# Altium project Placas para Carlos.PrjPcb
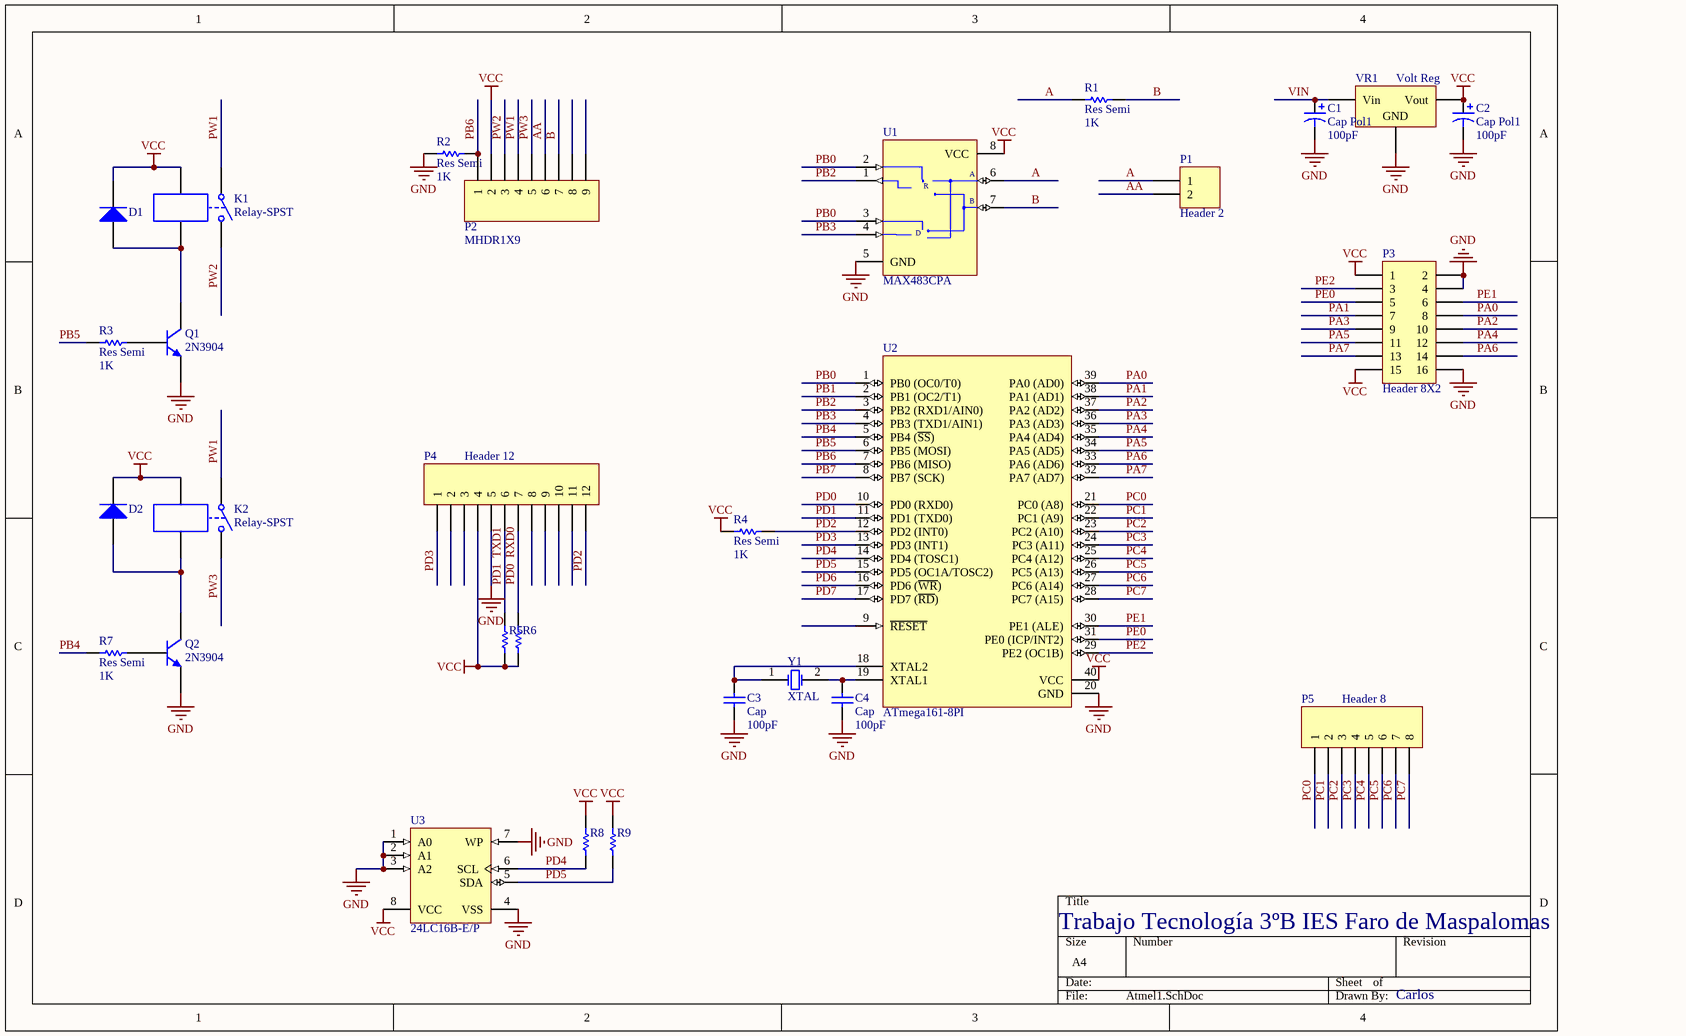
[diagram p0: Atmel1.SchDoc]
1 sheet, 29 parts. Net scope: global (net labels, ports and power ports of the same name join across sheets).

## Sheet Atmel1.SchDoc
size A4; PageSetup: Record=PageOptions|CenterHorizontal=True|CenterVertical=True|PrintScale=0.97|XCorrection=1.00|YCorrection=1.00|PrintKind=0|BorderSize=5000000|LeftOffset=0|BottomOffset=0|Orientation=2|PaperLength=1000|PaperWidth=1000|Scale=100|PaperSource=7|PrintQuality=-4|MediaType=1|DitherType=10|PaperKind=A4|PrintScaleMode=1

### Parts
C1  Cap Pol1  value 100pF  [RB7.6-15]
C2  Cap Pol1  value 100pF  [RB7.6-15]
C3  Cap  value 100pF  [RAD-0.3]
C4  Cap  value 100pF  [RAD-0.3]
D1  Diode 1N4148  [DO-35]  (value not drawn)
D2  Diode 1N4148  [DO-35]  (value not drawn)
K1  Relay-SPST  [MODULE4]
K2  Relay-SPST  [MODULE4]
P1  Header 2  [HDR1X2]
P2  MHDR1X9  [MHDR1X9]
P3  Header 8X2  [HDR2X8]
P4  Header 12  [HDR1X12]
P5  Header 8  [HDR1X8]
Q1  2N3904  [TO-92A]
Q2  2N3904  [TO-92A]
R1  Res Semi  value 1K  [AXIAL-0.5]
R2  Res Semi  value 1K  [AXIAL-0.5]
R3  Res Semi  value 1K  [AXIAL-0.5]
R4  Res Semi  value 1K  [AXIAL-0.5]
R5  Res Semi  [AXIAL-0.5]  (value not drawn)
R6  Res Semi  [AXIAL-0.5]  (value not drawn)
R7  Res Semi  value 1K  [AXIAL-0.5]
R8  Res Semi  [AXIAL-0.5]  (value not drawn)
R9  Res Semi  [AXIAL-0.5]  (value not drawn)
U1  MAX483CPA  [PA8]
U2  ATmega161-8PI  [40P6]
U3  24LC16B-E/P  [PDIP300-P8]
VR1  Volt Reg  [D2PAK_N]
Y1  XTAL  [R38]

### Nets
GND: C1.2 C2.2 C3.1 C4.1 P3.2 P3.4 P3.16 P4.5 Q1.1(E) Q2.1(E) R2.1 U1.5(GND) U2.20(GND) U3.1(A0) U3.2(A1) U3.3(A2) U3.4(VSS) U3.7(WP) VR1.2(GND)
VCC: C2.1 D1.2(K) D2.2(K) K1.3 K2.3 P2.2 P3.1 P3.15 P4.4 R4.1 R5.1 R6.1 R8.2 R9.2 U1.8(VCC) U2.40(VCC) U3.8(VCC) VR1.3(Vout)
A: P1.1 R1.1 U1.6(A)
AA: P1.2 P2.6
B: P2.7 R1.2 U1.7(B)
PA0: P3.8 U2.39(PA0_(AD0))
PA1: P3.7 U2.38(PA1_(AD1))
PA2: P3.10 U2.37(PA2_(AD2))
PA3: P3.9 U2.36(PA3_(AD3))
PA4: P3.12 U2.35(PA4_(AD4))
PA5: P3.11 U2.34(PA5_(AD5))
PA6: P3.14 U2.33(PA6_(AD6))
PA7: P3.13 U2.32(PA7_(AD7))
PB0: U1.2(~{RE}) U1.3(DE) U2.1(PB0_(OC0/T0))
PB1: U2.2(PB1_(OC2/T1))
PB2: U1.1(RO) U2.3(PB2_(RXD1/AIN0))
PB3: U1.4(DI) U2.4(PB3_(TXD1/AIN1))
PB4: R7.1 U2.5(PB4_(~{SS}))
PB5: R3.1 U2.6(PB5_(MOSI))
PB6: P2.1 R2.2 U2.7(PB6_(MISO))
PB7: U2.8(PB7_(SCK))
PC0: P5.1 U2.21(PC0_(A8))
PC1: P5.2 U2.22(PC1_(A9))
PC2: P5.3 U2.23(PC2_(A10))
PC3: P5.4 U2.24(PC3_(A11))
PC4: P5.5 U2.25(PC4_(A12))
PC5: P5.6 U2.26(PC5_(A13))
PC6: P5.7 U2.27(PC6_(A14))
PC7: P5.8 U2.28(PC7_(A15))
PD0: P4.7 R6.2 U2.10(PD0_(RXD0))  [also labelled RXD0]
PD1: P4.6 R5.2 U2.11(PD1_(TXD0))  [also labelled TXD1]
PD2: P4.12 R4.2 U2.12(PD2_(INT0))
PD3: P4.1 U2.13(PD3_(INT1))
PD4: R8.1 U2.14(PD4_(TOSC1)) U3.6(SCL)
PD5: R9.1 U2.15(PD5_(OC1A/TOSC2)) U3.5(SDA)
PD6: U2.16(PD6_(~{WR}))
PD7: U2.17(PD7_(~{RD}))
PE0: P3.5 U2.31(PE0_(ICP/INT2))
PE1: P3.6 U2.30(PE1_(ALE))
PE2: P3.3 U2.29(PE2_(OC1B))
PW1: K1.1 K2.1 P2.4
PW2: K1.2 P2.3
PW3: K2.2 P2.5
VIN: C1.1 VR1.1(Vin)
NetC3_2: C3.2 U2.18(XTAL2) Y1.1(OSC1)
NetC4_2: C4.2 U2.19(XTAL1) Y1.2(OSC2)
NetD1_1: D1.1(A) K1.4 Q1.3(C)
NetD2_1: D2.1(A) K2.4 Q2.3(C)
NetQ1_2: Q1.2(B) R3.2
NetQ2_2: Q2.2(B) R7.2

Not connected (* = marked no-connect by the designer): P2 8 9; P4 2 3 8 9 10 11; U2 9(~{RESET})

### Notes on the sheet
- Trabajo Tecnología 3ºB IES Faro de Maspalomas
- Carlos
- (in symbol MAX483CPA) R; D

### Library data of the parts
C1 C2 = Cap Pol1: Polarized Capacitor (Radial); Published: 8-Jun-2000; LatestRevisionDate: 17-Jul-2002; LatestRevisionNote: Re-released for DXP Platform.; PackageReference: RB7.6-15; Publisher: Altium Limited; PackageDescription: Polarized Capacitor (Radial); 2 Leads
C3 C4 = Cap: Capacitor; Published: 8-Jun-2000; LatestRevisionDate: 17-Jul-2002; LatestRevisionNote: Re-released for DXP Platform.; PackageReference: RAD-0.3; Publisher: Altium Limited; PackageDescription: Radial Cap, Thru-Hole; 2 Leads; 0.3 in Pin Spacing
D1 D2 = Diode 1N4148: High Conductance Fast Diode; Published: 8-Jun-2000; LatestRevisionDate: 17-Jul-2002; LatestRevisionNote: Re-released for DXP Platform.; DatasheetVersion: 1997; PackageReference: DO-35; Publisher: Altium Limited; PackageDescription: Diode, Axial; Body 3.8 x 1.9 mm (LxDia. max), Lead Dia. 0.53 mm (max); Code_JEDEC: DO-204-AH; ComponentLink1Description: Manufacturer Link; ComponentLink1URL: http://www.fairchildsemi.com/; ComponentLink2Description: Datasheet; ComponentLink2URL: http://www.fairchildsemi.com/ds/1N%2F1N4148.pdf
K1 K2 = Relay-SPST: Single-Pole Single-Throw Relay; Published: 24-Mar-1999; LatestRevisionDate: 17-Jul-2002; LatestRevisionNote: Re-released for DXP Platform.; PackageReference: MODULE4; Publisher: Altium Limited
P1 = Header 2: Header, 2-Pin; LatestRevisionDate: 17-Jul-2002; LatestRevisionNote: Re-released for DXP Platform.; Publisher: Altium Limited
P2 = MHDR1X9: Header, 9-Pin; LatestRevisionDate: 17-Jul-2002; LatestRevisionNote: Re-released for DXP Platform.; Publisher: Altium Limited
P3 = Header 8X2: Header, 8-Pin, Dual row; LatestRevisionDate: 17-Jul-2002; LatestRevisionNote: Re-released for DXP Platform.; Publisher: Altium Limited
P4 = Header 12: Header, 12-Pin; LatestRevisionDate: 17-Jul-2002; LatestRevisionNote: Re-released for DXP Platform.; Publisher: Altium Limited
P5 = Header 8: Header, 8-Pin; LatestRevisionDate: 17-Jul-2002; LatestRevisionNote: Re-released for DXP Platform.; Publisher: Altium Limited
Q1 Q2 = 2N3904: NPN General Purpose Amplifier; Published: 8-Jun-2000; LatestRevisionDate: 15-Jan-2003; LatestRevisionNote: PCB Footprint 'BCY-W3/D4.7' replaced; DatasheetVersion: 1997; PackageVersion: Sep-1998; PackageReference: TO-92A; Publisher: Altium Limited; PackageDescription: TO, Flat Index; 3 In-Line, Axial Leads; Body Dia. 4.5mm; Leads 0.51 x 0.48 mm (max); ComponentLink1Description: Manufacturer Link; ComponentLink1URL: http://www.fairchildsemi.com/; ComponentLink2Description: Datasheet; ComponentLink2URL: http://www.fairchildsemi.com/ds/2N%2F2N3904.pdf
R1-R4 R7 = Res Semi: Semiconductor Resistor; Published: 8-Jun-2000; LatestRevisionDate: 17-Jul-2002; LatestRevisionNote: Re-released for DXP Platform.; PackageReference: AXIAL-0.5; Publisher: Altium Limited; PackageDescription: Axial Device, Thru-Hole; 2 Leads; 0.5 in Pin Spacing
R5 R6 R8 R9 = Res Semi: Semiconductor Resistor; Value: 1K; Published: 8-Jun-2000; LatestRevisionDate: 17-Jul-2002; LatestRevisionNote: Re-released for DXP Platform.; PackageReference: AXIAL-0.5; Publisher: Altium Limited; PackageDescription: Axial Device, Thru-Hole; 2 Leads; 0.5 in Pin Spacing
U1 = MAX483CPA: Low-Power, Slew-Rate-Limited RS-485/RS-422 Transceiver; Published: 16-Jan-2001; LatestRevisionDate: 29-May-2009; LatestRevisionNote: Component Body Added.; DatasheetVersion: Feb-1996; PackageVersion: RevB, 21-0043; PackageReference: PA8; Publisher: Altium Limited; PackageDescription: DIP, 8-Pin, Row Spacing 7.62 mm, Pitch 2.54 mm; Code_JEDEC: MS-001-AB; ComponentLink1Description: Manufacturer Link; ComponentLink1URL: http://www.maxim-ic.com/; ComponentLink2Description: Datasheet; ComponentLink2URL: http://pdfserv.maxim-ic.com/en/ds/MAX1487-MAX491.pdf
U2 = ATmega161-8PI: 8-Bit AVR Microcontroller with 16K Bytes of In-System Programmable Flash Memory; Published: 17-Sep-2003; LatestRevisionDate: 04-Mar-2005; LatestRevisionNote: Stylized 3D Model Added.; DatasheetVersion: 1228C-AVR-08/02; PackageVersion: Dec-1999; PackageReference: 40P6; Publisher: Altium Limited; PackageDescription: DIP; 40 Leads; Row Spacing 15.24 mm; Pitch 2.54 mm; ComponentLink1Description: Manufacturer Link; ComponentLink1URL: http://www.atmel.com; ComponentLink2Description: Datasheet; ComponentLink2URL: http://www.atmel.com/dyn/resources/prod_documents/doc1228.pdf
U3 = 24LC16B-E/P: 16Kbit, 400kHz, 2.5V, I2C Serial EEPROM, 8-Pin PDIP, Extended Temperature; FirstPublished: 29-Jan-2009; DatasheetVersion: revJ, Oct-2009; PackageVersion: revBB, Aug-2009; PackageReference: PDIP300-P8; Publisher: Altium Limited; PackageDescription: 8-Lead Plastic Dual In-Line (P) - 300 mil Body [PDIP]; Supplier 1: Digi-Key; Supplier Part Number 1: 24LC16B-E/P-ND; Supplier 2: Newark; Supplier Part Number 2: 92C7143; Code_JEDEC: MS-001; ComponentLink1Description: Datasheet; ComponentLink1URL: http://ww1.microchip.com/downloads/en/DeviceDoc/21703J.pdf; ComponentLink2Description: Packaging Specification; ComponentLink2URL: http://www.microchip.com/stellent/groups/techpub_sg/documents/packagingspec/en012702.pdf; ComponentLink3Description: Microchip.com Home; ComponentLink3URL: http://www.microchip.com/
VR1 = Volt Reg: Voltage Regulator; Published: 24-Mar-1999; LatestRevisionDate: 29-May-2009; LatestRevisionNote: IPC-7351 Footprint Added.; PackageReference: D2PAK; Publisher: Altium Limited; PackageDescription: 3-Pin Transistor Outline Package 2.54 mm Pitch, 15.1 mm Lead Span
Y1 = XTAL: Crystal Oscillator; Published: 8-Jun-2000; LatestRevisionDate: 17-Jul-2002; LatestRevisionNote: Re-released for DXP Platform.; PackageReference: R38; Publisher: Altium Limited; PackageDescription: Crystal, Thru-Hole; 2 Leads; Body 3.1 x 8.2 mm (Dia.xH)